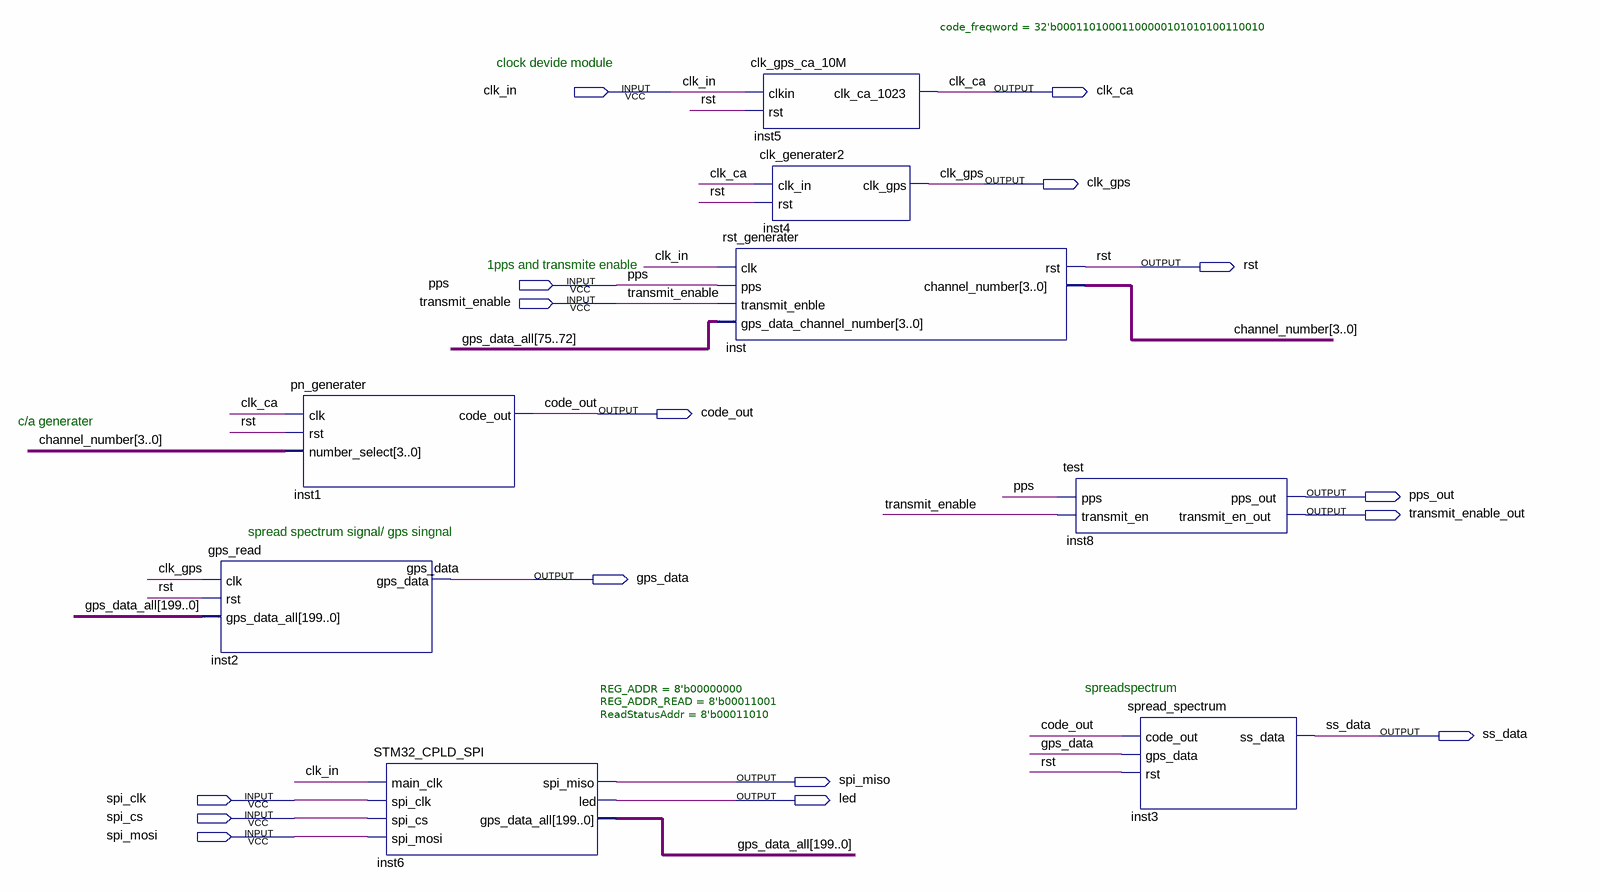
[diagram p0: schematic sheet]
// Quartus schematic spi_test.bdf as structural Verilog: 8 symbols, 16 pins
module spi_test (
  input  clk_in,
  input  pps,
  input  transmit_enable,
  input  spi_clk,
  input  spi_cs,
  input  spi_mosi,
  output clk_ca,
  output clk_gps,
  output rst,
  output code_out,
  output pps_out,
  output transmit_enable_out,
  output gps_data,
  output ss_data,
  output spi_miso,
  output led
);

  wire [3:0] channel_number;
  wire [199:0] gps_data_all;

  gps_read inst2 (.clk(clk_gps), .rst(rst), .gps_data_all(gps_data_all), .gps_data(gps_data));
  pn_generater inst1 (.clk(clk_ca), .rst(rst), .number_select(channel_number), .code_out(code_out));
  STM32_CPLD_SPI #(.REG_ADDR(8'b00000000), .REG_ADDR_READ(8'b00011001), .ReadStatusAddr(8'b00011010)) inst6 (
    .main_clk(clk_in), .spi_clk(spi_clk), .spi_cs(spi_cs), .spi_mosi(spi_mosi), .spi_miso(spi_miso),
    .led(led), .gps_data_all(gps_data_all));
  rst_generater inst (
    .clk(clk_in), .pps(pps), .transmit_enble(transmit_enable), .gps_data_channel_number(gps_data_all[75:72]),
    .rst(rst), .channel_number(channel_number));
  clk_gps_ca_10M #(.code_freqword(32'b00011010001100000101010100110010)) inst5 (
    .clkin(clk_in), .rst(rst), .clk_ca_1023(clk_ca));
  clk_generater2 inst4 (.clk_in(clk_ca), .rst(rst), .clk_gps(clk_gps));
  test inst8 (.pps(pps), .transmit_en(transmit_enable), .pps_out(pps_out), .transmit_en_out(transmit_enable_out));
  spread_spectrum inst3 (.code_out(code_out), .gps_data(gps_data), .rst(rst), .ss_data(ss_data));

  // Notes on the sheet:
  //   clock devide module
  //   1pps and transmite enable
  //   c/a generater
  //   spread spectrum signal/ gps singnal
  //   spreadspectrum
endmodule
